# EAGLE design capSwitch (EAGLE 7.1.0)
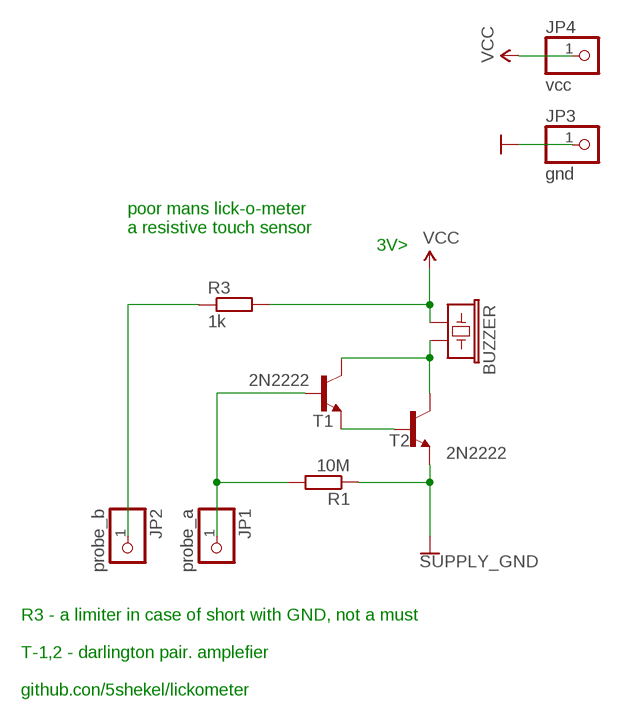
[diagram p0: schematic, sheet 1]

## Parts
BUZZER  BUZZERSMD2-KIT  [BUZZER-CCV-KIT]
JP1  probe_a  HEADER-1X1  [1X01_OVAL]
JP2  probe_b  HEADER-1X1  [1X01_OVAL]
JP3  gnd  HEADER-1X1  [1X01_OVAL]
JP4  vcc  HEADER-1X1  [1X01_OVAL]
R1  10M  RESISTOR-PTH-0.4  [RTH025W]
R3  1k  RESISTOR-PTH-0.4  [RTH025W]
T1  2N2222  [TO92-EBC-OVAL]
T2  2N2222  [TO92-EBC-OVAL]

## Nets
GND: JP3.1 R1.1 T2.E ; supply symbol labelled SUPPLY_GND, gnd
N$2: BUZZER.- T1.C T2.C
N$3: JP2.1 R3.1
N$4: JP1.1 R1.2 T1.B
N$6: T1.E T2.B
VCC: BUZZER.+ JP4.1 R3.2

## Notes on the sheet
- poor mans lick-o-meter
  a resistive touch sensor
- 3V>
- R3 - a limiter in case of short with GND, not a must
  
  T-1,2 - darlington pair. amplefier
  
  github.con/5shekel/lickometer

## Library data of the parts
BUZZER = SparkFun-Electromechanical:BUZZER: Buzzer 12mm Spark Fun Electronics SKU : Comp-Buzzer
JP1-JP4 = microbuilder:HEADER-1X1: PIN HEADER
R1 R3 = dp_devices:RESISTOR
T1 T2 = adafruit:2N2222: NPN TRANSISTOR Big oval pads

## Board
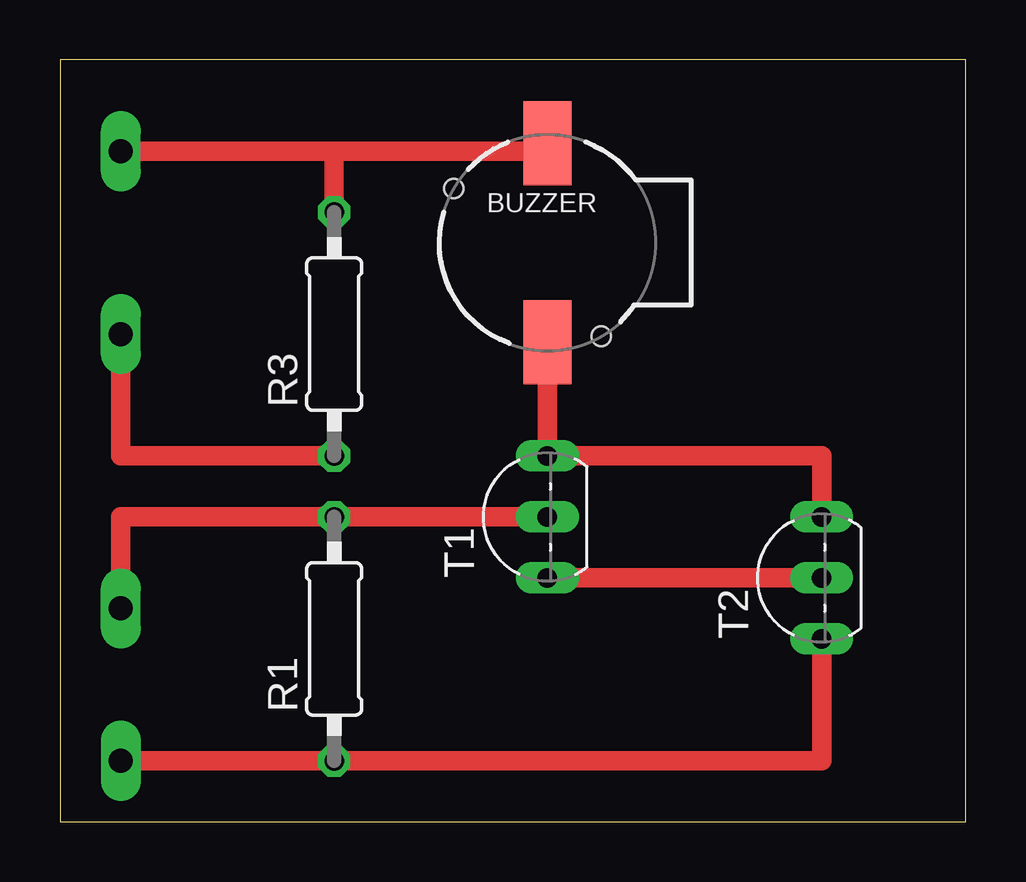
[diagram p1: board, top side]

Size 37.77 x 31.74 mm. Coordinates in mm from the lower left corner, seen from the top.
Outline: 0,0 37.77,0 37.77,31.74 0,31.74 0,0
Copper layers (1*16): Top 0.035mm / dielectric 1.5mm / Bottom 0.035mm
Design rules "default": minimum track width 10mil, minimum drill 0.6mm, track to track 8mil, track to pad 8mil, pad to pad 8mil, via to via 8mil, smd to smd 8mil, copper to edge 40mil, drill to drill 8mil, minimum pad ring 10mil, minimum via ring 8mil, stop-mask expansion 4mil, vias tented up to drill 0mil, thermal gap 10mil

### Footprints (pad centres in the part's own frame; a part is rotated, then mirrored left to right if it is on the bottom)
BUZZER-CCV-KIT = smd 3.5 x 2: + 4.15,0; - -4.15,0 | hole 0.8: -3.9,-2.25; 2.25,3.9
1X01_OVAL = drill 1 pad 1.676 long: 1 0,0
RTH025W = drill 0.813 octagon: 1 -5.08,0; 2 5.08,0
TO92-EBC-OVAL = drill 0.813 long: B 0,-1.27; C 2.54,-1.27; E -2.54,-1.27

### Placement (x,y rotation side)
BUZZER  20.32,24.13 90 top
JP1  2.54,8.89 0 top
JP2  2.54,20.32 0 top
JP3  2.54,2.54 180 top
JP4  2.54,27.94 0 top
R1  11.43,7.62 90 top
R3  11.43,20.32 90 top
T1  19.05,12.7 90 top
T2  30.48,10.16 90 top

### Tracks (layer width: path | path; a pad name or v marks a point on that pad's centre or on a via)
GND
  Top 0.813: T2.E 31.75,2.54 R1.1 JP3.1
N$2
  Top 0.813: T2.C 31.75,15.24 T1.C BUZZER.-
N$3
  Top 0.813: R3.1 2.54,15.24 JP2.1
N$4
  Top 0.813: T1.B R1.2 2.54,12.7 JP1.1
N$6
  Top 0.813: T2.B T1.E
VCC
  Top 0.813: JP4.1 11.43,27.94 | 11.43,27.94 R3.2 | 11.43,27.94 20.32,27.94 BUZZER.+

### Text on the board
tPlace: BUZZER